# Altium schematic sheet power.SchDoc: Power
size A4; SheetNumber: 4; SheetTotal: 6
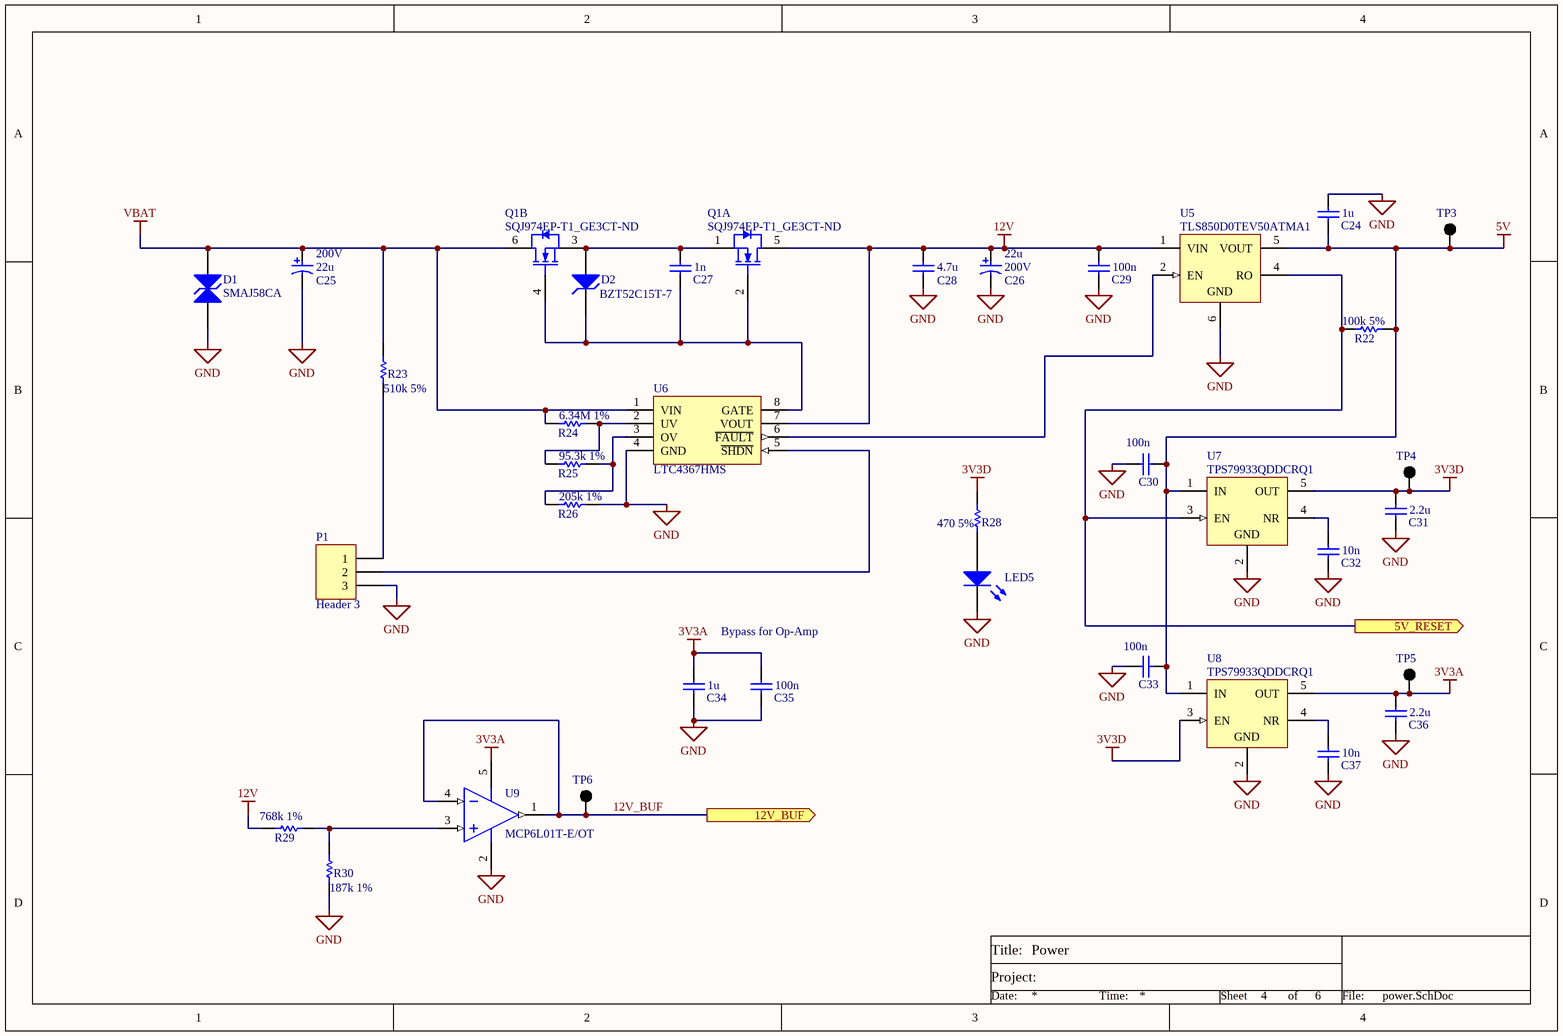
[diagram p0: power.SchDoc]

## Parts
C24  value 1u  [0805]  (hidden comment: Generic 0805 Capacitor)
C25  value 22u  Voltage: 200V  [NIC-UUX2A470MNL1GS_M]  (hidden comment: Generic Electrolytic Capacitor)
C26  value 22u  Voltage: 200V  [NIC-UUX2A470MNL1GS_M]  (hidden comment: Generic Electrolytic Capacitor)
C27  value 1n  [0805]  (hidden comment: Generic 0805 Capacitor)
C28  value 4.7u  [0805]  (hidden comment: Generic 0805 Capacitor)
C29  value 100n  [0805]  (hidden comment: Generic 0805 Capacitor)
C30  value 100n  [0805]  (hidden comment: Generic 0805 Capacitor)
C31  value 2.2u  [0805]  (hidden comment: Generic 0805 Capacitor)
C32  value 10n  [0805]  (hidden comment: Generic 0805 Capacitor)
C33  value 100n  [0805]  (hidden comment: Generic 0805 Capacitor)
C34  value 1u  [0805]  (hidden comment: Generic 0805 Capacitor)
C35  value 100n  [0805]  (hidden comment: Generic 0805 Capacitor)
C36  value 2.2u  [0805]  (hidden comment: Generic 0805 Capacitor)
C37  value 10n  [0805]  (hidden comment: Generic 0805 Capacitor)
D1  SMAJ58CA  [VISH-DO-214AC-2_M]
D2  BZT52C15T-7  [DIOD-SOD123-2_V]
LED5  150080SS75000  [0805_A]  (value not drawn)
P1  Header 3  [HDR1X3]
Q1  SQJ974EP-T1_GE3CT-ND  [VISH-POWERPAKSO-8_A_V]  (parts A,B of 2)
R22  value 100k 5%  [0603]  (hidden comment: Generic 0603 Resistor)
R23  value 510k 5%  [0603]  (hidden comment: Generic 0603 Resistor)
R24  value 6.34M 1%  [0603]  (hidden comment: Generic 0603 Resistor)
R25  value 95.3k 1%  [0603]  (hidden comment: Generic 0603 Resistor)
R26  value 205k 1%  [0603]  (hidden comment: Generic 0603 Resistor)
R28  value 470 5%  [0603]  (hidden comment: Generic 0603 Resistor)
R29  value 768k 1%  [0603]  (hidden comment: Generic 0603 Resistor)
R30  value 187k 1%  [0603]  (hidden comment: Generic 0603 Resistor)
TP3  5001  [KSTN-5001]  (value not drawn)
TP4  5001  [KSTN-5001]  (value not drawn)
TP5  5001  [KSTN-5001]  (value not drawn)
TP6  5001  [KSTN-5001]  (value not drawn)
U5  TLS850D0TEV50ATMA1  [KVU0005A_M]
U6  LTC4367HMS  [MSOP8_M]
U7  TPS79933QDDCRQ1  [DDC0005A_M]
U8  TPS79933QDDCRQ1  [DDC0005A_M]
U9  MCP6L01T-E/OT  [DDC0005A_M]

## Ports
5V_RESET (out), 12V_BUF (out)

## Nets
3V3A: C34.2 C35.2 C36.2 TP5.1 U8.5(OUT) U9.5(VDD)
3V3D: C31.2 R28.2 TP4.1 U7.5(OUT) U8.3(EN)
5V: C24.1 C30.2 C33.1 R22.2 TP3.1 U5.5(VOUT) U7.1(IN) U8.1(IN)
12V: C26.1 C28.2 C29.2 Q1.5(G2) R29.1 U5.1(VIN) U6.7(VOUT)
GND: C24.2 C25.2 C26.2 C28.1 C29.1 C30.1 C31.1 C32.1 C33.2 C34.1 C35.1 C36.1 C37.1 D1.1(A1) LED5.1(K) P1.3 R26.2 R30.1 U5.6(GND) U6.4(GND) U7.2(GND) U8.2(GND) U9.2(VSS)
VBAT: C25.1 D1.2(A2) Q1.6(G2) R23.2 R24.1 U6.1(VIN)
5V_RESET: R22.1 U5.4(RO) U7.3(EN) ; port 5V_RESET
12V_BUF: TP6.1 U9.1(VOUT) U9.4(VIN-) ; port 12V_BUF
NetC27_1: C27.1 D2.2(K) Q1.2(G2) Q1.4(G2) U6.8(GATE)
NetC27_2: C27.2 D2.1(A) Q1.1(S2) Q1.3(S2)
NetC32_2: C32.2 U7.4(NR)
NetC37_2: C37.2 U8.4(NR)
NetLED5_2: LED5.2(A) R28.1
NetP1_1: P1.1 R23.1
NetP1_2: P1.2 U6.5(~{SHDN})
NetR24_2: R24.2 R25.1 U6.2(UV)
NetR25_2: R25.2 R26.1 U6.3(OV)
NetR29_2: R29.2 R30.2 U9.3(VIN+)
NetU5_2: U5.2(EN) U6.6(~{FAULT})

## Notes on the sheet
- Bypass for Op-Amp
- Title
- Title:
- Project:
- Size:
- Date:
- File:
- E
- Number:
- Time:
- Revision:
- Sheet
- of

## Library data of the parts
C24 C27-C37 = C_0805: Specifications: *
C25 C26 = C_can: Generic PCAP_10x10 Can Aluminum Electrolytic Capacitor
D1 = SMAJ58CA: Transient Voltage Suppressor, 6.40 to 231 V, 58 V Stand-off Voltage, Bi-Directional, -55 to 155 degC, 2-pin DO-214AC, Pb-Free, Tape and Reel; Manufacturer: Vishay Semiconductor; PartNumber: SMAJ58CA-E3/5A; VWM (V): 58; IFSM: 40 A; VBR Bi-Directional (V): 6.4 to 231; ID (uA): 2; PPPM (W): 400, 300; ComponentLink2Description: Datasheet; ComponentLink1URL: http://www.vishay.com/; ComponentLink2URL: http://www.vishay.com/docs/88390/smaj50a.pdf; PackageReference: DO-214AC-2; Operating Junction and Storage Temperature Range: -55 to 150 degC; DatasheetVersion: 12/8/2013; ComponentLink3Description: Package Specification; RoHS: TRUE; Mounting Technology: Surface Mount; ComponentLink1Description: Manufacturer URL; PackageDescription: 2-Pin DO-214AC (SMA), Body 4.245 x 2.665 mm; ComponentLink3URL: http://www.vishay.com/docs/88390/smaj50a.pdf; Packing: Tape and Reel; Supplier 1: Digi-Key; Supplier Part Number 1: SMAJ58CALFCT-ND
D2 = BZT52C15T: Zener Diode 15V 300mW ±6% Surface Mount SOD-523; Manufacturer: Diodes Inc; PartNumber: BZT52C16-7-F; Maximum Reverse Current: 0.1 uA; Tol V: 5.56% Typ.; Maximum Zener Impedance f: 1 kHz ZZK=200 Ohm; Voltage Zener: 16 V Typ.; Packing: Tape and Reel; Power Max: 500 mW; ComponentLink2URL: http://www.diodes.com/datasheets/ds18004.pdf; PackageDescription: 2-Pin SOD123, Body 2.7 x 1.55 mm, Height 1.45 mm; ComponentLink3Description: Package Specification; Mounting Technology: Surface Mount; PackageReference: SOD123; ComponentLink2Description: Datasheet; RoHS: TRUE; ComponentLink3URL: http://www.diodes.com/datasheets/ap02002.pdf; Operating Temperature: -65 to 150 degC; DatasheetVersion: Rev. 37-2; ComponentLink1Description: Manufacturer URL; ComponentLink1URL: http://www.diodes.com/; PackageVersion: Rev. 79
LED5 = LED_0805: SMD mono-color Chip LED, WL-SMCW, Super Red; Manufacturer: Wuerth Elektronik; PackageReference: 0805_A; ComponentLink2URL: http://katalog.we-online.com/led/datasheet/150080SS75000.pdf; ComponentLink1URL: http://www.we-online.com; Color: Super Red; ComponentLink2Description: Datasheet; ComponentLink1Description: Manufacturer URL; PartNumber: 150080SS75000
P1 = Header 3: Header, 3-Pin; LatestRevisionDate: 17-Jul-2002; LatestRevisionNote: Re-released for DXP Platform.; Publisher: Altium Limited
Q1 = SQJ974EP: Mosfet Array 2 N-Channel (Dual) 100V 30A (Tc) 48W Surface Mount PowerPAK® SO-8 Dual; Manufacturer: Vishay; Gate Charge (Qg) @ Vgs: 15nC@10V; FET Feature: Standard; Rds On (Max) @ Id, Vgs: 19mOhm@10A,10V; Drain to Source Voltage (Vdss): 40V; Other Names: SI7288DP-T1-GE3DKR; Online Catalog: N-ChannelStandardFETs; Power - Max: 15.6W; PCN Assembly/Origin: MultipleFabracationChanges09/Jul/2014; Input Capacitance (Ciss) @ Vds: 565pF@20V; Current - Continuous Drain (Id) @ 25°C: 20A; Vgs(th) (Max) @ Id: 2.8V@250µA; Package Reference: POWERPAKSO-8; Datasheet URL: http://www.vishay.com/docs/65366/si7288dp.pdf; Package Description: 8-Pin Surface Mount Device, Body 6.15 x 5.155 mm, Pitch 1.27 mm; Manufacturer URL: http://www.vishay.com/; Package / Case: PowerPAK®SO-8Dual; Category: DiscreteSemiconductorProducts; Mounting Type: SurfaceMount; Standard Package: 1; Mounting Technology: SurfaceMount; Series: TrenchFET®; Datasheet Version: Rev. A, 10/2009; Supplier Device Package: PowerPAK®SO-8Dual; Family: FETs-Arrays; Packaging: Digi-Reel®; FET Type: 2N-Channel(Dual)
R22-R26 R28-R30 = R_0603: Specifications: *
TP3-TP6 = TP5001: Test Point, Black, 1-Pin THD, RoHS, Bulk; Manufacturer: Keystone; Other Names: 5001K; Catalog Drawings: 5000Series; Alternate Color: 5004K-ND / -TESTPOINTPCMINI.040"DYELLOW / 5003K-ND / -TESTPOINTPCMINI.040"DORANGE / 5002K-ND / -TESTPOINTPCMINI.040"DWHITE / 5000K-ND / -TESTPOINTPCMINI.040"DRED; Kits: DKTGRS232C-KIT-ND / -TTLCONVERTER; Online Catalog: ColorCodedTestPoints; Datasheet URL: https://ciiva.com/datasheet-click-2917627?src=ciiva&sig=bd195616; Mounting Type: 0.040"(1.02mm)HoleDiameter; Family: TestPoints; RoHS Information: RoHSComplianceStatement; Datasheet Version: Rev. G, 12/2008; Color: Black; Category: TestandMeasurement; Standard Package: 100; Manufacturer URL: http://www.keyelco.com/; Material: Base,Nylon46,UL94V-0; Type: PCTestPoint,Miniature; Terminal: 0.010"x0.020"(0.25mmx0.51mm)PhosphorBronzeWire,SilverPlated; Series: THM; Packaging: Bulk
U5 = TLS850D0TE: Linear Voltage Regulator IC  1 Output  500mA PG-TO252-5; PartNumber: TPS7A6150QKVURQ1; Manufacturer: Texas Instruments; Vin(Min)(V): 4; Fixed Output Options(V): 5; Vdo(Typ)(mV): 300; Accuracy(%): 2; Iq(Typ)(mA): 0.02; Iout(Max)(A): 0.3; SubFamily: Single Channel LDO; Vin(Max)(V): 40; Eco-Plan: Green (RoHS & no Sb/Br); PackageReference: KVU0005A; ComponentLink2URL: http://www.ti.com/general/docs/lit/getliterature.tsp?genericPartNumber=TPS7A6150-Q1&fileType=pdf; PackageDescription: 5-Pin Plastic Flange Mount, Body 6.1 x 6.6 mm, Pitch 1.14 mm; Vout Adj(Max)(V): 5; ComponentLink1Description: Manufacturer URL; ComponentLink1URL: http://www.ti.com/; DatasheetVersion: SLVSA62G; ComponentLink2Description: Datasheet; Mounting Technology: Surface Mount; PackageVersion: 4205521-3/D; Vout Adj(Min)(V): 5; ComponentLink3Description: Package Specification; Code_JEDEC: TO-252; ComponentLink3URL: http://www.ti.com/lit/ml/mpsf019/mpsf019.pdf; Supplier 1: Digi-Key; Supplier Part Number 1: 296-36856-6-ND
U6 = LTC4367: 100V Overvoltage, Undervoltage and Reverse Supply Protection Controller; ComponentLink1Description: Manufacturer URL; ComponentLink3Description: Package Specification; ComponentLink2URL: http://cds.linear.com/docs/en/datasheet/4356fa.pdf; ComponentLink3URL: http://cds.linear.com/docs/en/packaging/05081661_F_MS.pdf; ComponentLink1URL: http://www.linear.com/; ComponentLink2Description: Datasheet
U7 U8 = TPS79933: Single Output High PSRR LDO, 200 mA, Fixed 3.3 V Output, 2.7 to 6.5 V Input, with Low IQ, 5-pin SOT (DDC), -40 to 125 degC, Green (RoHS & no Sb/Br); Manufacturer: Texas Instruments; Accuracy(%): 2; Vin(Max)(V): 6.5; SubFamily: Single Channel LDO; Iout(Max)(A): 0.2; Vdo(Typ)(mV): 90; Fixed Output Options(V): 3.3; Iq(Typ)(mA): 0.04; Rating: Automotive; Vin(Min)(V): 2.7; ComponentLink2Description: Datasheet; ComponentLink3Description: Package Specification; PackageVersion: 4204403-2/E; ComponentLink1URL: http://www.ti.com/; ComponentLink3URL: http://www.ti.com/litv/pdf/mpds123d; ComponentLink2URL: http://www.ti.com/general/docs/lit/getliterature.tsp?genericPartNumber=TPS79933-Q1&fileType=pdf; PackageReference: DDC0005A; PackageDescription: 5-Pin Plastic Small Outline, Body 2.9 x 1.6 mm, 0.95 mm Pitch; ComponentLink4Description: URL Link1; PartNumber: TPS79933QDDCRQ1; DatasheetVersion: SBVS097E; Mounting Technology: Surface Mount; ComponentLink1Description: Manufacturer URL; Eco-Plan: Green (RoHS & no Sb/Br); Vout Adj(Max)(V): 3.3; Vout Adj(Min)(V): 3.3; ComponentLink4URL: Samples URL:http://www.ti.com/product/tps79933-q1#samples; Code_JEDEC: MO-193
U9 = MCP6L01: 1 MHz, 85 uA Op Amp, 5-Pin SOT-23, Extended Temperature Range; Code_IPC: SOT23-5; ComponentLink3Description: Package Specification; PackageVersion: revBB, Aug-2009; ComponentLink3URL: http://www.microchip.com/stellent/groups/techpub_sg/documents/packagingspec/en012702.pdf; ComponentLink1Description: Manufacturer URL; DatasheetVersion: revB, Sep-2011; PackageDescription: 5-Lead Plastic Small Outline Transistor (OT) [SOT-23]; PackageReference: SOT-23-OT5; ComponentLink1URL: http://www.microchip.com/; ComponentLink2Description: Datasheet; ComponentLink2URL: http://ww1.microchip.com/downloads/en/DeviceDoc/22140b.pdf; RevisionNote: URLs added. DatasheetVersion updated.